# Altium project BLD-motor.PrjPCB
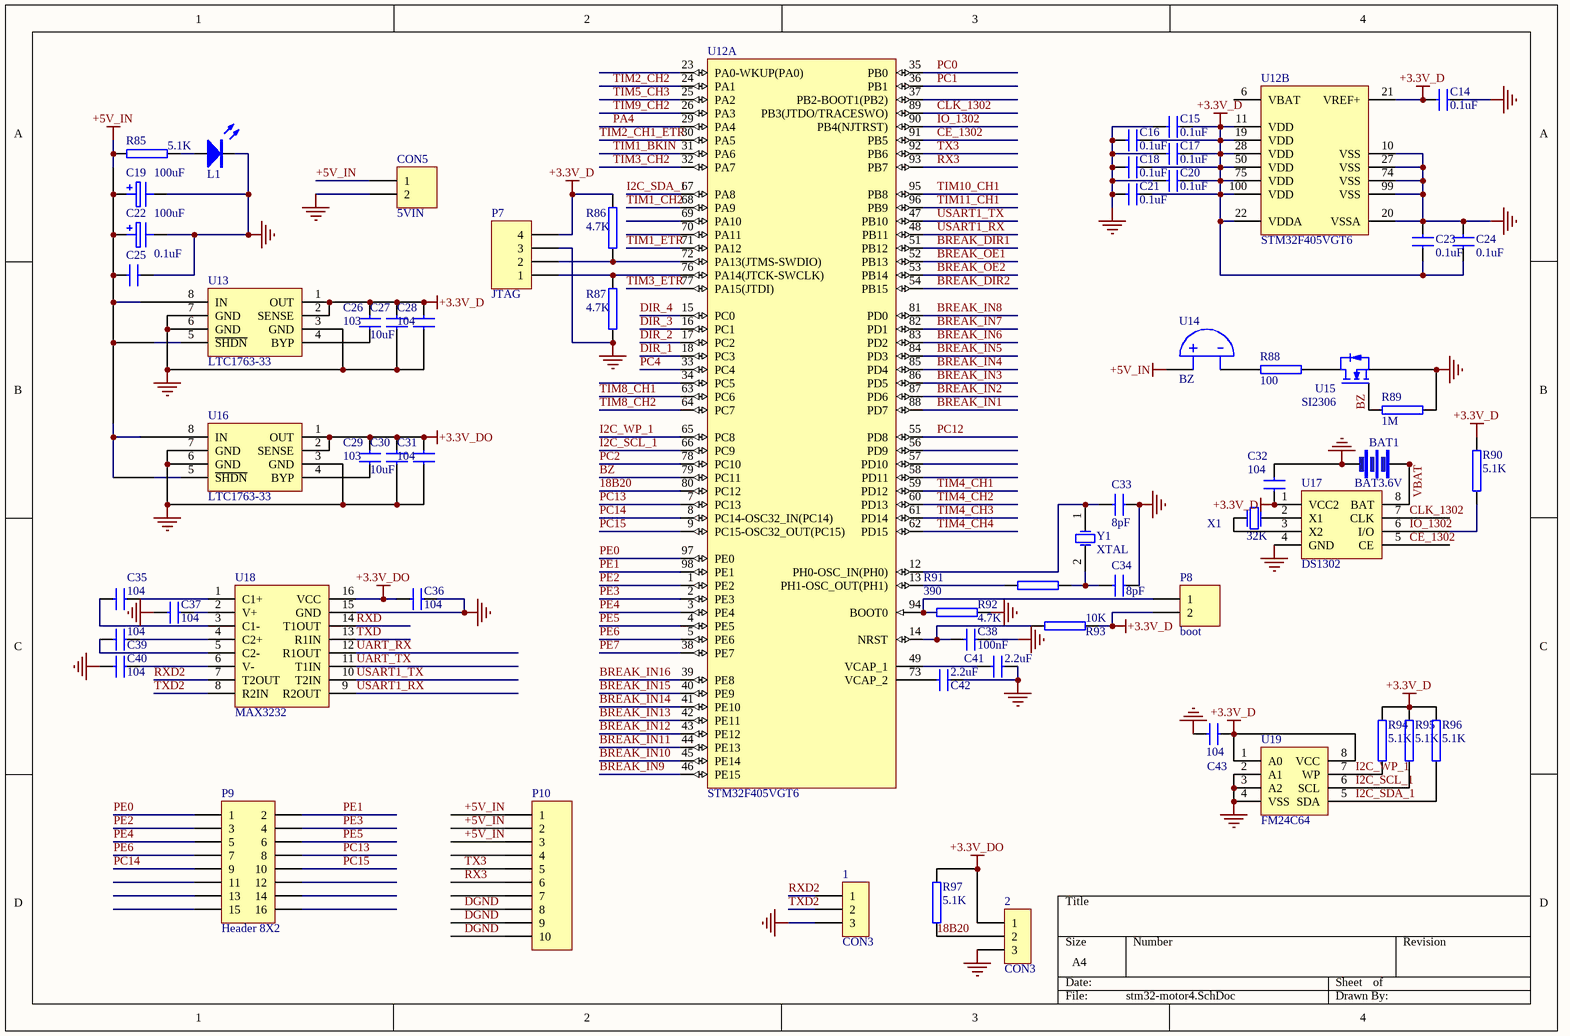
[diagram p0: stm32-motor4.SchDoc]
2 sheets, 167 parts. Net scope: global (net labels, ports and power ports of the same name join across sheets).
Board file: motor4-PCB.PcbDoc
Sheets:
  stm32-motor4.SchDoc
  motor-drive.SchDoc

## Sheet stm32-motor4.SchDoc
size A4

### Parts
1  CON3  [SIP3]
2  CON3  [SIP3]
BAT1  BAT3.6V  [BAT]
C14  0.1uF  [0805]
C15  0.1uF  [0805]
C16  0.1uF  [0805]
C17  0.1uF  [0805]
C18  0.1uF  [0805]
C19  100uF  [100UF/25V_CA]
C20  0.1uF  [0805]
C21  0.1uF  [0805]
C22  100uF  [100UF/25V_CA]
C23  0.1uF  [0805]
C24  0.1uF  [0805]
C25  0.1uF  [0805]
C26  103  [0603]
C27  10uF  [0805]
C28  104  [0805]
C29  103  [0603]
C30  10uF  [0805]
C31  104  [0805]
C32  104  [0805]
C33  8pF  [0805]
C34  8pF  [0805]
C35  104  [0805]
C36  104  [0805]
C37  104  [0805]
C38  100nF  [0805]
C39  104  [0805]
C40  104  [0805]
C41  2.2uF  [0805]
C42  2.2uF  [0805]
C43  104  [0805]
CON5  5VIN  [CON2]
L1  LED  [0805LED]  (value not drawn)
P7  JTAG  [HDR1X4]
P8  boot  [0603]
P9  Header 8X2  [HDR2X8]
P10  ping  [PCBComponent_1]  (value not drawn)
R85  5.1K  [0805]
R86  4.7K  [0805]
R87  4.7K  [0805]
R88  100  [0805]
R89  1M  [0805]
R90  5.1K  [0805]
R91  390  [0805]
R92  4.7K  [0805]
R93  10K  [0805]
R94  5.1K  [0805]
R95  5.1K  [0805]
R96  5.1K  [0805]
R97  5.1K  [0805]
U12  STM32F405VGT6  [STM-LQFP100_N]  (parts A,B of 2)
U13  LTC1763-33  [SO-8]
U14  BZ  [BZ_SMALL]
U15  SI2306  [SOT-23]
U16  LTC1763-33  [SO-8]
U17  DS1302  [SO-8]
U18  MAX3232  [SO-16]
U19  FM24C64  [SO-8]
X1  32K  [XTAL-2]
Y1  XTAL  [XTAL1]

### Nets
+3.3V_D: C14.1 C15.2 C16.2 C17.2 C18.2 C20.2 C21.2 C23.2 C24.2 C26.1 C27.1 C28.1 C32.2 C43.1 P7.4 P8.2 R86.1 R90.2 R93.2 R94.2 R95.2 R96.2 U12.11(VDD) U12.19(VDD) U12.21(VREF+) U12.22(VDDA) U12.28(VDD) U12.50(VDD) U12.75(VDD) U12.100(VDD) U13.1(OUT) U13.2(SENSE) U17.1(VCC2) U19.1(A0) U19.8(VCC)
+3.3V_DO: 2.1 C29.1 C30.1 C31.1 C36.1 R97.2 U16.1(OUT) U16.2(SENSE) U18.16(VCC)
+5V_IN: C19.1 C22.1 C25.1 CON5.1 P10.1 P10.2 P10.3 R85.2 U13.5(~{SHDN}) U13.8(IN) U14.1 U16.5(~{SHDN}) U16.8(IN)
DGND: 1.3 2.3 BAT1.2 C14.2 C15.1 C16.1 C17.1 C18.1 C19.2 C20.1 C21.1 C22.2 C23.1 C24.1 C25.2 C27.2 C28.2 C30.2 C31.2 C32.1 C33.2 C34.2 C36.2 C37.1 C38.2 C40.1 C41.2 C42.2 C43.2 CON5.2 L1.2(K) P7.3 P10.8 P10.9 P10.10 R87.2 R89.1 R92.1 U12.10(VSS) U12.20(VSSA) U12.27(VSS) U12.74(VSS) U12.99(VSS) U13.3(GND) U13.6(GND) U13.7(GND) U15.E U16.3(GND) U16.6(GND) U16.7(GND) U17.4(GND) U18.15(GND) U19.2(A1) U19.3(A2) U19.4(VSS)
18B20: 2.2 R97.1 U12.80(PC12)
BREAK_DIR1: U12.51(PB12)
BREAK_DIR2: U12.54(PB15)
BREAK_IN1: U12.88(PD7)
BREAK_IN2: U12.87(PD6)
BREAK_IN3: U12.86(PD5)
BREAK_IN4: U12.85(PD4)
BREAK_IN5: U12.84(PD3)
BREAK_IN6: U12.83(PD2)
BREAK_IN7: U12.82(PD1)
BREAK_IN8: U12.81(PD0)
BREAK_IN9: U12.46(PE15)
BREAK_IN10: U12.45(PE14)
BREAK_IN11: U12.44(PE13)
BREAK_IN12: U12.43(PE12)
BREAK_IN13: U12.42(PE11)
BREAK_IN14: U12.41(PE10)
BREAK_IN15: U12.40(PE9)
BREAK_IN16: U12.39(PE8)
BREAK_OE1: U12.52(PB13)
BREAK_OE2: U12.53(PB14)
BZ: R89.2 U12.79(PC11) U15.B
CE_1302: U12.91(PB5) U17.5(CE)
CLK_1302: U12.89(PB3(JTDO/TRACESWO)) U17.7(CLK)
DIR_1: U12.18(PC3)
DIR_2: U12.17(PC2)
DIR_3: U12.16(PC1)
DIR_4: U12.15(PC0)
I2C_SCL_1: R95.1 U12.66(PC9) U19.6(SCL)
I2C_SDA_1: R96.1 U12.67(PA8) U19.5(SDA)
I2C_WP_1: R94.1 U12.65(PC8) U19.7(WP)
IO_1302: R90.1 U12.90(PB4(NJTRST)) U17.6(I/O)
PA4: U12.29(PA4)
PC0: U12.35(PB0)
PC1: U12.36(PB1)
PC2: U12.78(PC10)
PC4: U12.33(PC4)
PC12: U12.55(PD8)
PC13: P9.8 U12.7(PC13)
PC14: P9.9 U12.8(PC14-OSC32_IN(PC14))
PC15: P9.10 U12.9(PC15-OSC32_OUT(PC15))
PE0: P9.1 U12.97(PE0)
PE1: P9.2 U12.98(PE1)
PE2: P9.3 U12.1(PE2)
PE3: P9.4 U12.2(PE3)
PE4: P9.5 U12.3(PE4)
PE5: P9.6 U12.4(PE5)
PE6: P9.7 U12.5(PE6)
PE7: U12.38(PE7)
RX3: P10.6 U12.93(PB7)
RXD: U18.14(T1OUT)
RXD2: 1.1 U18.7(T2OUT)
TIM1_BKIN: U12.31(PA6)
TIM1_CH2: U12.68(PA9)
TIM1_ETR: U12.71(PA12)
TIM2_CH1_ETR: U12.30(PA5)
TIM2_CH2: U12.24(PA1)
TIM3_CH2: U12.32(PA7)
TIM3_ETR: U12.77(PA15(JTDI))
TIM4_CH1: U12.59(PD12)
TIM4_CH2: U12.60(PD13)
TIM4_CH3: U12.61(PD14)
TIM4_CH4: U12.62(PD15)
TIM5_CH3: U12.25(PA2)
TIM8_CH1: U12.63(PC6)
TIM8_CH2: U12.64(PC7)
TIM9_CH2: U12.26(PA3)
TIM10_CH1: U12.95(PB8)
TIM11_CH1: U12.96(PB9)
TX3: P10.5 U12.92(PB6)
TXD: U18.13(R1IN)
TXD2: 1.2 U18.8(R2IN)
UART_RX: U18.12(R1OUT)
UART_TX: U18.11(T1IN)
USART1_RX: U12.48(PB11) U18.9(R2OUT)
USART1_TX: U12.47(PB10) U18.10(T2IN)
VBAT: BAT1.1 U17.8(BAT)
NetC26_2: C26.2 U13.4(BYP)
NetC29_2: C29.2 U16.4(BYP)
NetC33_1: C33.1 U12.12(PH0-OSC_IN(PH0)) Y1.1(OSC1)
NetC34_1: C34.1 R91.2 Y1.2(OSC2)
NetC35_1: C35.1 U18.3(C1-)
NetC35_2: C35.2 U18.1(C1+)
NetC37_2: C37.2 U18.2(V+)
NetC38_1: C38.1 R93.1 U12.14(NRST)
NetC39_1: C39.1 U18.5(C2-)
NetC39_2: C39.2 U18.4(C2+)
NetC40_2: C40.2 U18.6(V-)
NetC41_1: C41.1 U12.49(VCAP_1)
NetC42_1: C42.1 U12.73(VCAP_2)
NetL1_1: L1.1(A) R85.1
NetP7_1: P7.1 R87.1 U12.76(PA14(JTCK-SWCLK))
NetP7_2: P7.2 R86.2 U12.72(PA13(JTMS-SWDIO))
NetP8_1: P8.1 R92.2 U12.94(BOOT0)
NetR88_1: R88.1 U15.C
NetR88_2: R88.2 U14.2
NetR91_1: R91.1 U12.13(PH1-OSC_OUT(PH1))
NetU17_2: U17.2(X1) X1.2(P2)
NetU17_3: U17.3(X2) X1.1(P1)

Not connected (* = marked no-connect by the designer): P9 11 12 13 14 15 16; P10 4 7; U12 6(VBAT) 23(PA0-WKUP(PA0)) 34(PC5) 37(PB2-BOOT1(PB2)) 56(PD9) 57(PD10) 58(PD11) 69(PA10) 70(PA11)

### Library data of the parts
1 2 = CON3: Connector
C14-C18 C20 C21 C23-C43 = C
C19 C22 = ELECTRO1
CON5 P8 = Header 2: Header, 2-Pin; Publisher: Altium Limited
  CON5: Revision: 17-Jul-2002: Re-released for DXP Platform.
  P8: LatestRevisionDate: 17-Jul-2002; LatestRevisionNote: Re-released for DXP Platform.
P7 = Header 4: Header, 4-Pin; LatestRevisionDate: 17-Jul-2002; LatestRevisionNote: Re-released for DXP Platform.; Publisher: Altium Limited
P9 = Header 8X2: Header, 8-Pin, Dual row; LatestRevisionDate: 17-Jul-2002; LatestRevisionNote: Re-released for DXP Platform.; Publisher: Altium Limited
P10 = Header 10: Header, 10-Pin; LatestRevisionDate: 17-Jul-2002; LatestRevisionNote: Re-released for DXP Platform.; Publisher: Altium Limited
R85-R97 = RES
U12 = STM32F405VGT6: ARM Cortex-M4 32-bit MCU+FPU, 210 DMIPS, 1024 kB Flash, 192 kB Internal RAM, 82 I/Os, 100-pin LQFP, -40 to 85 degC, Tray; Manufacturer: STMicroelectronics; D/A Converter: 2x12-bit; FLASH Size (Prog) (kB): 1024; I/Os (High Current): 82; Internal RAM Size (kB): 192; Operating Frequency(F) (Processor speed) (MHz): 168; Supply Voltage(Vcc) max (V): 3.6; Supply Voltage(Vcc) min (V): 1.8; DatasheetVersion: Rev. 4; PackageVersion: Rev. 1, 06/2013; PackageReference: LQFP100; PackageDescription: 100-Pin Low Profile Quad Flat Package, 14 x 14 mm Body, 0.5 mm Pitch; Supplier 1: Digi-Key; Supplier Part Number 1: 497-11910-ND; Supplier 2: Farnell; Supplier Part Number 2: 2215224; Supplier 3: Newark; Supplier Part Number 3: 46W2199; Supplier 4: Newark; Supplier Part Number 4: 94T6493; Supplier 5: Mouser; Supplier Part Number 5: 511-STM32F405VGT6; Core: ARM Cortex-M4; Packing: Tray; Mounting Technology: Surface Mount; PartNumber: STM32F405VGT6; ComponentLink1Description: Manufacturer URL; ComponentLink1URL: http://www.st.com/web/en/home.html; ComponentLink2Description: Datasheet; ComponentLink2URL: http://www.st.com/st-web-ui/static/active/en/resource/technical/document/datasheet/DM00037051.pdf; ComponentLink3Description: Package Specification; ComponentLink3URL: http://www.st.com/st-web-ui/static/active/en/resource/technical/document/data_brief/DM00071938.pdf
U13 U16 = LT1763
U15 = MOFET_N
X1 = XTAL
Y1 = XTAL: Crystal Oscillator; Published: 8-Jun-2000; LatestRevisionDate: 17-Jul-2002; LatestRevisionNote: Re-released for DXP Platform.; PackageReference: R38; Publisher: Altium Limited; PackageDescription: Crystal, Thru-Hole; 2 Leads; Body 3.1 x 8.2 mm (Dia.xH)

## Sheet motor-drive.SchDoc
size A3
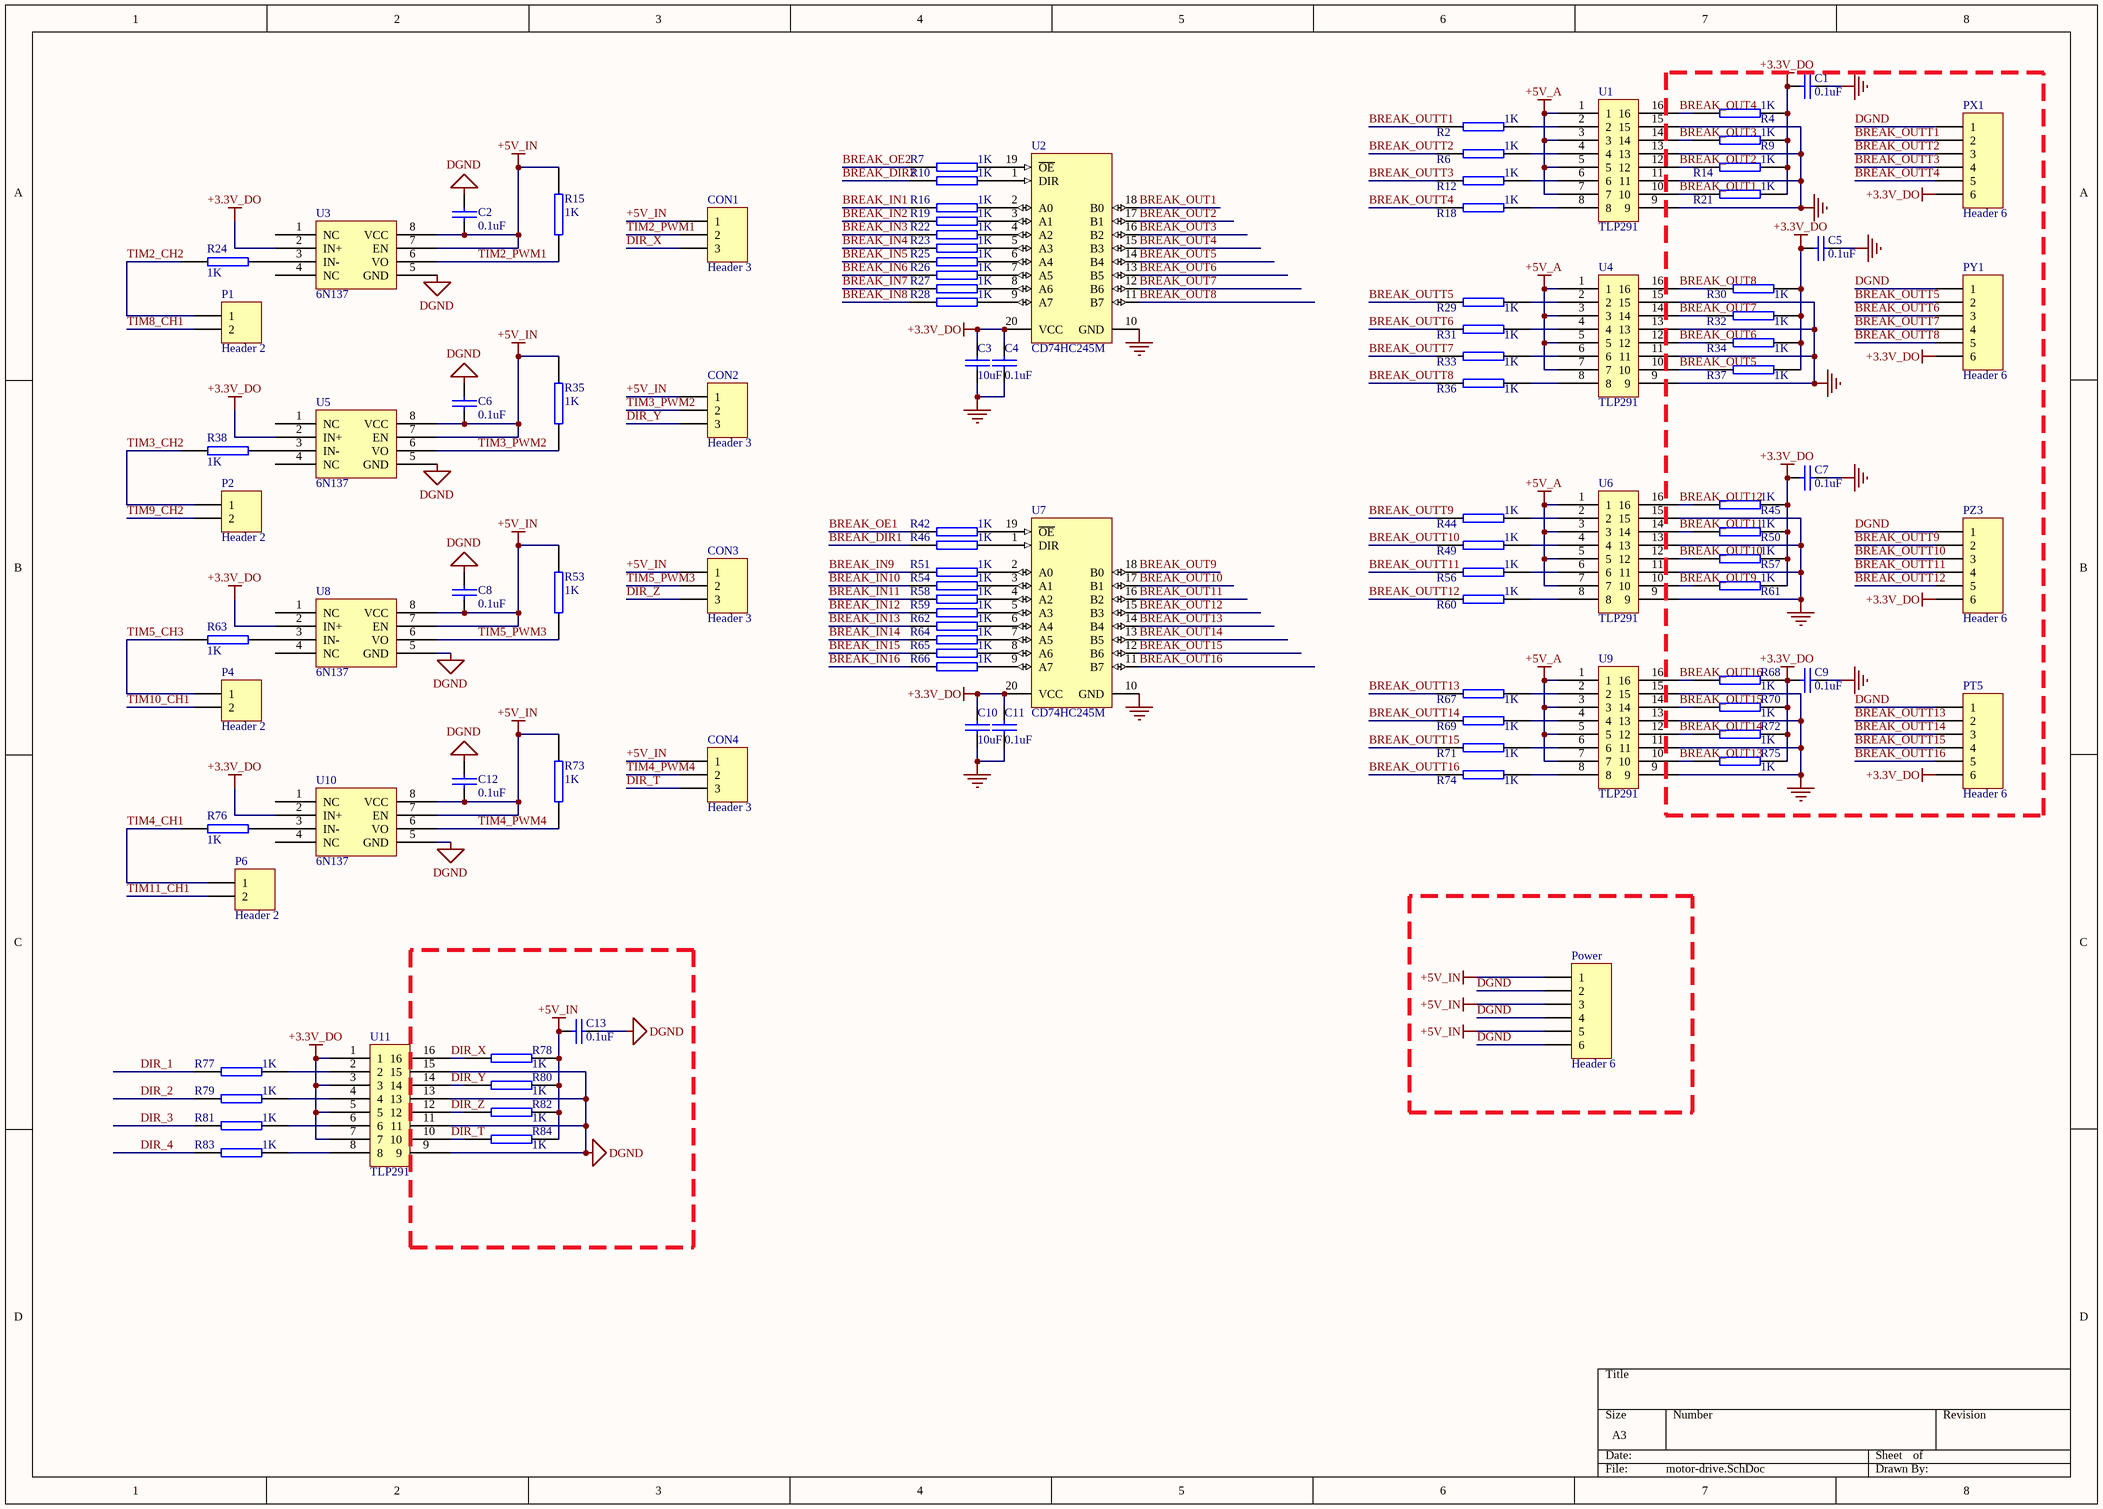
[diagram p1: motor-drive.SchDoc]

### Parts
C1  0.1uF  [0805]
C2  0.1uF  [0805]
C3  10uF  [0805]
C4  0.1uF  [0805]
C5  0.1uF  [0805]
C6  0.1uF  [0805]
C7  0.1uF  [0805]
C8  0.1uF  [0805]
C9  0.1uF  [0805]
C10  10uF  [0805]
C11  0.1uF  [0805]
C12  0.1uF  [0805]
C13  0.1uF  [0805]
CON1  Header 3  [CON3]
CON2  Header 3  [CON3]
CON3  Header 3  [CON3]
CON4  Header 3  [CON3]
P1  Header 2  [HDR1X2]
P2  Header 2  [HDR1X2]
P4  Header 2  [HDR1X2]
P6  Header 2  [HDR1X2]
Power  Header 6  [HDR1X6]
PT5  Header 6  [HDR1X6]
PX1  Header 6  [HDR1X6]
PY1  Header 6  [HDR1X6]
PZ3  Header 6  [HDR1X6]
R2  1K  [0805]
R4  1K  [0805]
R6  1K  [0805]
R7  1K  [0805]
R9  1K  [0805]
R10  1K  [0805]
R12  1K  [0805]
R14  1K  [0805]
R15  1K  [0805]
R16  1K  [0805]
R18  1K  [0805]
R19  1K  [0805]
R21  1K  [0805]
R22  1K  [0805]
R23  1K  [0805]
R24  1K  [0805]
R25  1K  [0805]
R26  1K  [0805]
R27  1K  [0805]
R28  1K  [0805]
R29  1K  [0805]
R30  1K  [0805]
R31  1K  [0805]
R32  1K  [0805]
R33  1K  [0805]
R34  1K  [0805]
R35  1K  [0805]
R36  1K  [0805]
R37  1K  [0805]
R38  1K  [0805]
R42  1K  [0805]
R44  1K  [0805]
R45  1K  [0805]
R46  1K  [0805]
R49  1K  [0805]
R50  1K  [0805]
R51  1K  [0805]
R53  1K  [0805]
R54  1K  [0805]
R56  1K  [0805]
R57  1K  [0805]
R58  1K  [0805]
R59  1K  [0805]
R60  1K  [0805]
R61  1K  [0805]
R62  1K  [0805]
R63  1K  [0805]
R64  1K  [0805]
R65  1K  [0805]
R66  1K  [0805]
R67  1K  [0805]
R68  1K  [0805]
R69  1K  [0805]
R70  1K  [0805]
R71  1K  [0805]
R72  1K  [0805]
R73  1K  [0805]
R74  1K  [0805]
R75  1K  [0805]
R76  1K  [0805]
R77  1K  [0805]
R78  1K  [0805]
R79  1K  [0805]
R80  1K  [0805]
R81  1K  [0805]
R82  1K  [0805]
R83  1K  [0805]
R84  1K  [0805]
U1  TLP291  [SOIC-TLP291-4-16N]
U2  CD74HC245M  [DW0020A_N]
U3  6N137  [SO-8]
U4  TLP291  [SOIC-TLP291-4-16N]
U5  6N137  [SO-8]
U6  TLP291  [SOIC-TLP291-4-16N]
U7  CD74HC245M  [DW0020A_N]
U8  6N137  [SO-8]
U9  TLP291  [SOIC-TLP291-4-16N]
U10  6N137  [SO-8]
U11  TLP291  [SOIC-TLP291-4-16N]

### Nets
+3.3V_DO: C1.1 C3.1 C4.2 C5.1 C7.1 C9.1 C10.1 C11.2 PT5.6 PX1.6 PY1.6 PZ3.6 R4.1 R9.1 R14.1 R21.1 R30.1 R32.1 R34.1 R37.1 R45.1 R50.1 R57.1 R61.1 R68.1 R70.1 R72.1 R75.1 U2.20(VCC) U3.2(IN+) U5.2(IN+) U7.20(VCC) U8.2(IN+) U10.2(IN+) U11.1 U11.3 U11.5 U11.7
+5V_A: U1.1 U1.3 U1.5 U1.7 U4.1 U4.3 U4.5 U4.7 U6.1 U6.3 U6.5 U6.7 U9.1 U9.3 U9.5 U9.7
+5V_IN: C2.2 C6.2 C8.2 C12.2 C13.1 CON1.1 CON2.1 CON3.1 CON4.1 Power.1 Power.3 Power.5 R15.2 R35.2 R53.2 R73.2 R78.2 R80.1 R82.1 R84.1 U3.7(EN) U3.8(VCC) U5.7(EN) U5.8(VCC) U8.7(EN) U8.8(VCC) U10.7(EN) U10.8(VCC)
DGND: C1.2 C2.1 C3.2 C4.1 C5.2 C6.1 C7.2 C8.1 C9.2 C10.2 C11.1 C12.1 C13.2 Power.2 Power.4 Power.6 PT5.1 PX1.1 PY1.1 PZ3.1 U1.9 U1.11 U1.13 U1.15 U2.10(GND) U3.5(GND) U4.9 U4.11 U4.13 U4.15 U5.5(GND) U6.9 U6.11 U6.13 U6.15 U7.10(GND) U8.5(GND) U9.9 U9.11 U9.13 U9.15 U10.5(GND) U11.9 U11.11 U11.13 U11.15
BREAK_DIR1: R46.1
BREAK_DIR2: R10.1
BREAK_IN1: R16.1
BREAK_IN2: R19.1
BREAK_IN3: R22.1
BREAK_IN4: R23.1
BREAK_IN5: R25.1
BREAK_IN6: R26.1
BREAK_IN7: R27.1
BREAK_IN8: R28.1
BREAK_IN9: R51.1
BREAK_IN10: R54.1
BREAK_IN11: R58.1
BREAK_IN12: R59.1
BREAK_IN13: R62.1
BREAK_IN14: R64.1
BREAK_IN15: R65.1
BREAK_IN16: R66.1
BREAK_OE1: R42.1
BREAK_OE2: R7.1
BREAK_OUT1: R21.2 U1.10 U2.18(B0)
BREAK_OUT2: R14.2 U1.12 U2.17(B1)
BREAK_OUT3: R9.2 U1.14 U2.16(B2)
BREAK_OUT4: R4.2 U1.16 U2.15(B3)
BREAK_OUT5: R37.2 U2.14(B4) U4.10
BREAK_OUT6: R34.2 U2.13(B5) U4.12
BREAK_OUT7: R32.2 U2.12(B6) U4.14
BREAK_OUT8: R30.2 U2.11(B7) U4.16
BREAK_OUT9: R61.2 U6.10 U7.18(B0)
BREAK_OUT10: R57.2 U6.12 U7.17(B1)
BREAK_OUT11: R50.2 U6.14 U7.16(B2)
BREAK_OUT12: R45.2 U6.16 U7.15(B3)
BREAK_OUT13: R75.2 U7.14(B4) U9.10
BREAK_OUT14: R72.2 U7.13(B5) U9.12
BREAK_OUT15: R70.2 U7.12(B6) U9.14
BREAK_OUT16: R68.2 U7.11(B7) U9.16
BREAK_OUTT1: PX1.2 R2.2
BREAK_OUTT2: PX1.3 R6.2
BREAK_OUTT3: PX1.4 R12.2
BREAK_OUTT4: PX1.5 R18.2
BREAK_OUTT5: PY1.2 R29.2
BREAK_OUTT6: PY1.3 R31.2
BREAK_OUTT7: PY1.4 R33.2
BREAK_OUTT8: PY1.5 R36.2
BREAK_OUTT9: PZ3.2 R44.2
BREAK_OUTT10: PZ3.3 R49.2
BREAK_OUTT11: PZ3.4 R56.2
BREAK_OUTT12: PZ3.5 R60.2
BREAK_OUTT13: PT5.2 R67.2
BREAK_OUTT14: PT5.3 R69.2
BREAK_OUTT15: PT5.4 R71.2
BREAK_OUTT16: PT5.5 R74.2
DIR_1: R77.2
DIR_2: R79.2
DIR_3: R81.2
DIR_4: R83.2
DIR_T: CON4.3 R84.2 U11.10
DIR_X: CON1.3 R78.1 U11.16
DIR_Y: CON2.3 R80.2 U11.14
DIR_Z: CON3.3 R82.2 U11.12
TIM2_CH2: P1.1 R24.1
TIM2_PWM1: CON1.2 R15.1 U3.6(VO)
TIM3_CH2: P2.1 R38.1
TIM3_PWM2: CON2.2 R35.1 U5.6(VO)
TIM4_CH1: P6.1 R76.1
TIM4_PWM4: CON4.2 R73.1 U10.6(VO)
TIM5_CH3: P4.1 R63.1
TIM5_PWM3: CON3.2 R53.1 U8.6(VO)
TIM8_CH1: P1.2
TIM9_CH2: P2.2
TIM10_CH1: P4.2
TIM11_CH1: P6.2
NetR2_1: R2.1 U1.2
NetR6_1: R6.1 U1.4
NetR7_2: R7.2 U2.19(~{OE})
NetR10_2: R10.2 U2.1(DIR)
NetR12_1: R12.1 U1.6
NetR16_2: R16.2 U2.2(A0)
NetR18_1: R18.1 U1.8
NetR19_2: R19.2 U2.3(A1)
NetR22_2: R22.2 U2.4(A2)
NetR23_2: R23.2 U2.5(A3)
NetR24_2: R24.2 U3.3(IN-)
NetR25_2: R25.2 U2.6(A4)
NetR26_2: R26.2 U2.7(A5)
NetR27_2: R27.2 U2.8(A6)
NetR28_2: R28.2 U2.9(A7)
NetR29_1: R29.1 U4.2
NetR31_1: R31.1 U4.4
NetR33_1: R33.1 U4.6
NetR36_1: R36.1 U4.8
NetR38_2: R38.2 U5.3(IN-)
NetR42_2: R42.2 U7.19(~{OE})
NetR44_1: R44.1 U6.2
NetR46_2: R46.2 U7.1(DIR)
NetR49_1: R49.1 U6.4
NetR51_2: R51.2 U7.2(A0)
NetR54_2: R54.2 U7.3(A1)
NetR56_1: R56.1 U6.6
NetR58_2: R58.2 U7.4(A2)
NetR59_2: R59.2 U7.5(A3)
NetR60_1: R60.1 U6.8
NetR62_2: R62.2 U7.6(A4)
NetR63_2: R63.2 U8.3(IN-)
NetR64_2: R64.2 U7.7(A5)
NetR65_2: R65.2 U7.8(A6)
NetR66_2: R66.2 U7.9(A7)
NetR67_1: R67.1 U9.2
NetR69_1: R69.1 U9.4
NetR71_1: R71.1 U9.6
NetR74_1: R74.1 U9.8
NetR76_2: R76.2 U10.3(IN-)
NetR77_1: R77.1 U11.2
NetR79_1: R79.1 U11.4
NetR81_1: R81.1 U11.6
NetR83_1: R83.1 U11.8

Not connected (* = marked no-connect by the designer): U3 1(NC) 4(NC); U5 1(NC) 4(NC); U8 1(NC) 4(NC); U10 1(NC) 4(NC)

### Library data of the parts
C1-C13 = CAP: Capacitor
CON1-CON4 = Header 3: Header, 3-Pin; Revision: 17-Jul-2002: Re-released for DXP Platform.; Publisher: Altium Limited
P1 P2 P4 P6 = Header 2: Header, 2-Pin; LatestRevisionDate: 17-Jul-2002; LatestRevisionNote: Re-released for DXP Platform.; Publisher: Altium Limited
Power PT5 PX1 PY1 PZ3 = Header 6: Header, 6-Pin; LatestRevisionDate: 17-Jul-2002; LatestRevisionNote: Re-released for DXP Platform.; Publisher: Altium Limited
R2 R4 R6 R7 R9 R10 R12 R14-R16 R18 R19 R21-R38 R42 R44-R46 R49-R51 R53 R54 R56-R84 = RES2
U1 U4 U6 U9 U11 = TLP291-4: 光耦隔离
U2 U7 = CD74HC245M: High Speed CMOS Logic Non-Inverting Octal-Bus Transceivers with 3-State Outputs, DW0020A, TUBE; Manufacturer: Texas Instruments; VCC(Min)(V): 2; VCC(Max)(V): 6; ICC @ Nom Voltage(Max)(mA): 0.08; Bits(#): 8; F @ Nom Voltage(Max)(Mhz): 29; Rating: Catalog; Technology Family: HC; Schmitt Trigger: No; Output Drive (IOL/IOH)(Max)(mA): -5.2/5.2; tpd @ Nom Voltage(Max)(ns): 24; DatasheetVersion: SCHS119A; PackageReference: DW0020A; Supplier 1: Digi-Key; Supplier Part Number 1: 296-9421-5-ND; Supplier 2: Farnell; Supplier Part Number 2: 1103163; Supplier 3: Newark; Supplier Part Number 3: 25M8636; Supplier 4: Mouser; Supplier Part Number 4: 595-CD74HC245M; Generic Part Number: CD74HC245; Output Type: CMOS; Input Type: CMOS; Operating Temperature Range(C): -55 to 125; Voltage(Nom)(V): 6; PartNumber: CD74HC245M; ComponentLink1Description: Manufacturer URL; ComponentLink1URL: http://www.ti.com/; ComponentLink2Description: Datasheet; ComponentLink2URL: http://www.ti.com/lit/ds/symlink/cd74hc245.pdf; ComponentLink3Description: Package Specification; ComponentLink3URL: http://www.ti.com/lit/ml/mpds173a/mpds173a.pdf
U3 U5 U8 U10 = HCPL2400

## Nets that join several sheets
+3.3V_DO: stm32-motor4 (9 pins), motor-drive (38 pins)
+5V_IN: stm32-motor4 (13 pins), motor-drive (28 pins)
DGND: stm32-motor4 (55 pins), motor-drive (46 pins)
BREAK_DIR1: stm32-motor4 (U12.51), motor-drive (R46.1)
BREAK_DIR2: stm32-motor4 (U12.54), motor-drive (R10.1)
BREAK_IN1: stm32-motor4 (U12.88), motor-drive (R16.1)
BREAK_IN2: stm32-motor4 (U12.87), motor-drive (R19.1)
BREAK_IN3: stm32-motor4 (U12.86), motor-drive (R22.1)
BREAK_IN4: stm32-motor4 (U12.85), motor-drive (R23.1)
BREAK_IN5: stm32-motor4 (U12.84), motor-drive (R25.1)
BREAK_IN6: stm32-motor4 (U12.83), motor-drive (R26.1)
BREAK_IN7: stm32-motor4 (U12.82), motor-drive (R27.1)
BREAK_IN8: stm32-motor4 (U12.81), motor-drive (R28.1)
BREAK_IN9: stm32-motor4 (U12.46), motor-drive (R51.1)
BREAK_IN10: stm32-motor4 (U12.45), motor-drive (R54.1)
BREAK_IN11: stm32-motor4 (U12.44), motor-drive (R58.1)
BREAK_IN12: stm32-motor4 (U12.43), motor-drive (R59.1)
BREAK_IN13: stm32-motor4 (U12.42), motor-drive (R62.1)
BREAK_IN14: stm32-motor4 (U12.41), motor-drive (R64.1)
BREAK_IN15: stm32-motor4 (U12.40), motor-drive (R65.1)
BREAK_IN16: stm32-motor4 (U12.39), motor-drive (R66.1)
BREAK_OE1: stm32-motor4 (U12.52), motor-drive (R42.1)
BREAK_OE2: stm32-motor4 (U12.53), motor-drive (R7.1)
DIR_1: stm32-motor4 (U12.18), motor-drive (R77.2)
DIR_2: stm32-motor4 (U12.17), motor-drive (R79.2)
DIR_3: stm32-motor4 (U12.16), motor-drive (R81.2)
DIR_4: stm32-motor4 (U12.15), motor-drive (R83.2)
TIM2_CH2: stm32-motor4 (U12.24), motor-drive (P1.1 R24.1)
TIM3_CH2: stm32-motor4 (U12.32), motor-drive (P2.1 R38.1)
TIM4_CH1: stm32-motor4 (U12.59), motor-drive (P6.1 R76.1)
TIM5_CH3: stm32-motor4 (U12.25), motor-drive (P4.1 R63.1)
TIM8_CH1: stm32-motor4 (U12.63), motor-drive (P1.2)
TIM9_CH2: stm32-motor4 (U12.26), motor-drive (P2.2)
TIM10_CH1: stm32-motor4 (U12.95), motor-drive (P4.2)
TIM11_CH1: stm32-motor4 (U12.96), motor-drive (P6.2)